# EAGLE design Faudraj (EAGLE 7.6.0)
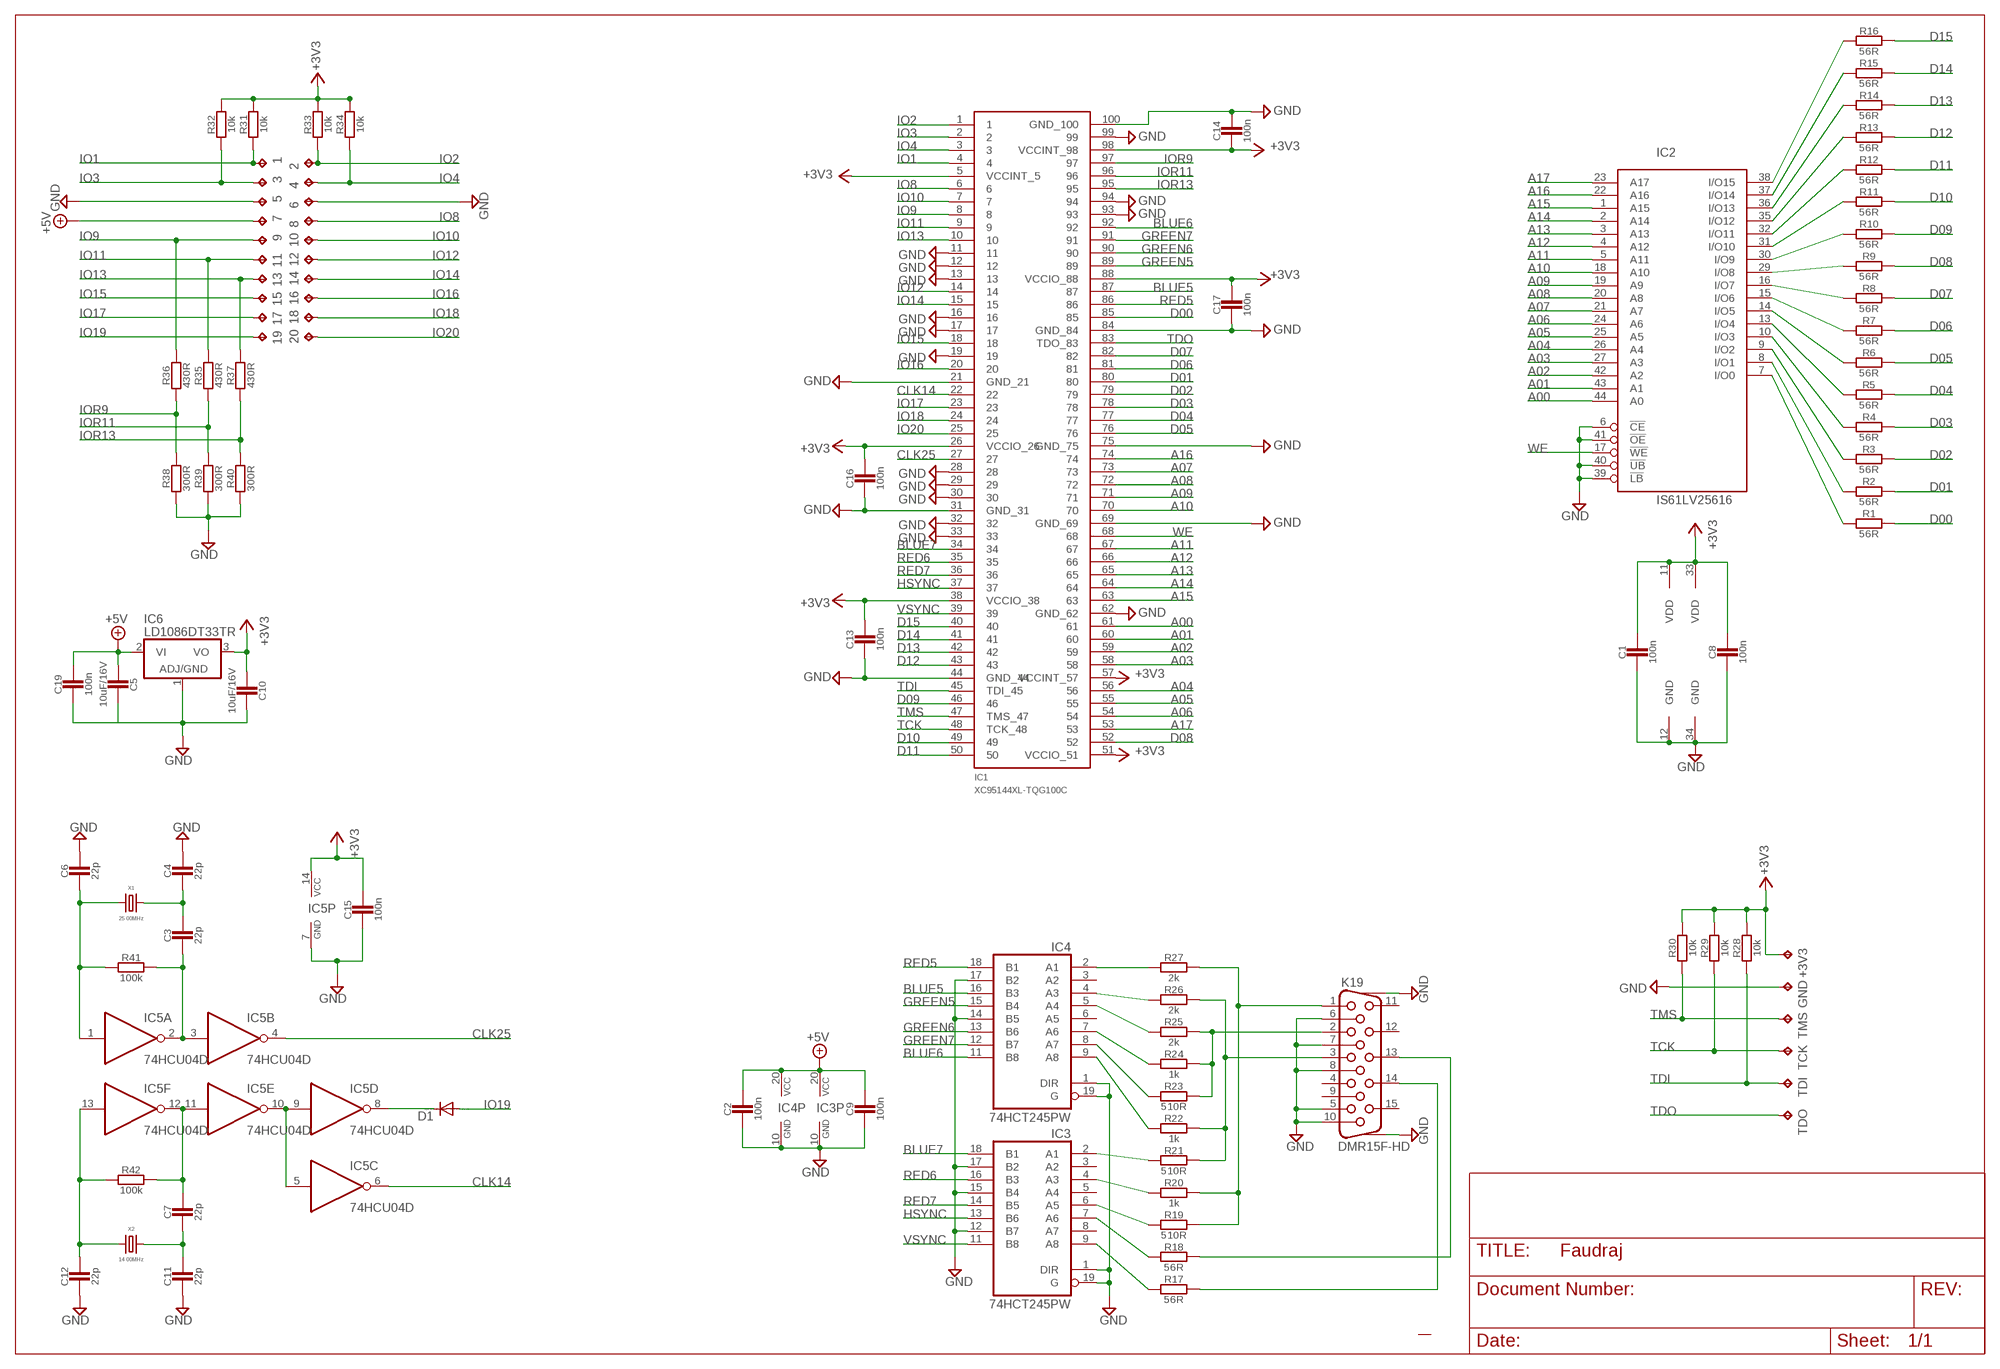
[diagram p0: schematic, sheet 1]

## Parts
1  nic  TPTP20R  [TP20R]
2  nic  TPTP20R  [TP20R]
3  nic  TPTP20R  [TP20R]
4  nic  TPTP20R  [TP20R]
5  nic  TPTP20R  [TP20R]
6  nic  TPTP20R  [TP20R]
7  nic  TPTP20R  [TP20R]
8  nic  TPTP20R  [TP20R]
9  nic  TPTP20R  [TP20R]
10  nic  TPTP20R  [TP20R]
11  nic  TPTP20R  [TP20R]
12  nic  TPTP20R  [TP20R]
13  nic  TPTP20R  [TP20R]
14  nic  TPTP20R  [TP20R]
15  nic  TPTP20R  [TP20R]
16  nic  TPTP20R  [TP20R]
17  nic  TPTP20R  [TP20R]
18  nic  TPTP20R  [TP20R]
19  nic  TPTP20R  [TP20R]
20  nic  TPTP20R  [TP20R]
+3V3  nic  TPTP20R  [TP20R]
C1  100n  CSMD0603  [SMD0603]
C2  100n  CSMD0603  [SMD0603]
C3  22p  CSMD0603  [SMD0603]
C4  22p  CSMD0603  [SMD0603]
C5  10uF/16V  CSMD1206  [SMD1206]
C6  22p  CSMD0603  [SMD0603]
C7  22p  CSMD0603  [SMD0603]
C8  100n  CSMD0603  [SMD0603]
C9  100n  CSMD0603  [SMD0603]
C10  10uF/16V  CSMD1206  [SMD1206]
C11  22p  CSMD0603  [SMD0603]
C12  22p  CSMD0603  [SMD0603]
C13  100n  CSMD0603  [SMD0603]
C14  100n  CSMD0603  [SMD0603]
C15  100n  CSMD0603  [SMD0603]
C16  100n  CSMD0603  [SMD0603]
C17  100n  CSMD0603  [SMD0603]
C19  100n  CSMD0603  [SMD0603]
D1  DIODE-MINIMELF  [MINIMELF]
GND  nic  TPTP20R  [TP20R]
IC1  XC95144XL-TQG100C  XC95144XL100  [TQFP100]
IC2  IS61LV25616  IS61C25616AL-10T  [TSOP-II-44]
IC3  74HCT245PW  74245PW  [TSSOP20]
IC4  74HCT245PW  74245PW  [TSSOP20]
IC5  74HCU04D  74HCT04D  [SO14]
IC6  LD1086DT33TR  LM1117DT  [TO252]
K19  DMR15F-HD  HF15G  [HF15G]
R1  56R  RSMD0603  [SMD0603]
R2  56R  RSMD0603  [SMD0603]
R3  56R  RSMD0603  [SMD0603]
R4  56R  RSMD0603  [SMD0603]
R5  56R  RSMD0603  [SMD0603]
R6  56R  RSMD0603  [SMD0603]
R7  56R  RSMD0603  [SMD0603]
R8  56R  RSMD0603  [SMD0603]
R9  56R  RSMD0603  [SMD0603]
R10  56R  RSMD0603  [SMD0603]
R11  56R  RSMD0603  [SMD0603]
R12  56R  RSMD0603  [SMD0603]
R13  56R  RSMD0603  [SMD0603]
R14  56R  RSMD0603  [SMD0603]
R15  56R  RSMD0603  [SMD0603]
R16  56R  RSMD0603  [SMD0603]
R17  56R  RSMD0603  [SMD0603]
R18  56R  RSMD0603  [SMD0603]
R19  510R  RSMD0603  [SMD0603]
R20  1k  RSMD0603  [SMD0603]
R21  510R  RSMD0603  [SMD0603]
R22  1k  RSMD0603  [SMD0603]
R23  510R  RSMD0603  [SMD0603]
R24  1k  RSMD0603  [SMD0603]
R25  2k  RSMD0603  [SMD0603]
R26  2k  RSMD0603  [SMD0603]
R27  2k  RSMD0603  [SMD0603]
R28  10k  RSMD0603  [SMD0603]
R29  10k  RSMD0603  [SMD0603]
R30  10k  RSMD0603  [SMD0603]
R31  10k  RSMD0603  [SMD0603]
R32  10k  RSMD0603  [SMD0603]
R33  10k  RSMD0603  [SMD0603]
R34  10k  RSMD0603  [SMD0603]
R35  430R  RSMD0603  [SMD0603]
R36  430R  RSMD0603  [SMD0603]
R37  430R  RSMD0603  [SMD0603]
R38  300R  RSMD0603  [SMD0603]
R39  300R  RSMD0603  [SMD0603]
R40  300R  RSMD0603  [SMD0603]
R41  100k  RSMD0603  [SMD0603]
R42  100k  RSMD0603  [SMD0603]
SJ1  nic  OTVOR3.2  [OTVOR3.2]
TCK  nic  TPTP20R  [TP20R]
TDI  nic  TPTP20R  [TP20R]
TDO  nic  TPTP20R  [TP20R]
TMS  nic  TPTP20R  [TP20R]
X1  25.00MHz  CRYSTALHC49U-V  [HC49U-V]
X2  14.00MHz  CRYSTALHC49U-V  [HC49U-V]

## Nets
+3V3: +3V3.TP C1.1 C8.1 C10.2 C13.1 C14.2 C15.1 C16.1 C17.1 IC1.5(VCCINT_5) IC1.26(VCCIO_26) IC1.38(VCCIO_38) IC1.51(VCCIO_51) IC1.57(VCCINT_57) IC1.88(VCCIO_88) IC1.98(VCCINT_98) IC2.11(VDD) IC2.33(VDD) IC5.14(P:VCC) IC6.3(VO) R28.2 R29.2 R30.2 R31.2 R32.2 R33.2 R34.2
+5V: 7.TP C2.1 C5.2 C9.1 C19.1 IC3.20(VCC) IC4.20(VCC) IC6.2(VI)
A00: IC1.61 IC2.44(A0)
A01: IC1.60 IC2.43(A1)
A02: IC1.59 IC2.42(A2)
A03: IC1.58 IC2.27(A3)
A04: IC1.56 IC2.26(A4)
A05: IC1.55 IC2.25(A5)
A06: IC1.54 IC2.24(A6)
A07: IC1.73 IC2.21(A7)
A08: IC1.72 IC2.20(A8)
A09: IC1.71 IC2.19(A9)
A10: IC1.70 IC2.18(A10)
A11: IC1.67 IC2.5(A11)
A12: IC1.66 IC2.4(A12)
A13: IC1.65 IC2.3(A13)
A14: IC1.64 IC2.2(A14)
A15: IC1.63 IC2.1(A15)
A16: IC1.74 IC2.22(A16)
A17: IC1.53 IC2.23(A17)
B5: IC4.4(A3) R26.1
B6: IC4.9(A8) R22.1
B7: IC3.2(A1) R21.1
BLUE5: IC1.87 IC4.16(B3)
BLUE6: IC1.92 IC4.11(B8)
BLUE7: IC1.34 IC3.18(B1)
CLK14: IC1.22 IC5.6(C:O)
CLK25: IC1.27 IC5.4(B:O)
D00: IC1.85 R1.2
D01: IC1.80 R2.2
D02: IC1.79 R3.2
D03: IC1.78 R4.2
D04: IC1.77 R5.2
D05: IC1.76 R6.2
D06: IC1.81 R7.2
D07: IC1.82 R8.2
D08: IC1.52 R9.2
D09: IC1.46 R10.2
D10: IC1.49 R11.2
D11: IC1.50 R12.2
D12: IC1.43 R13.2
D13: IC1.42 R14.2
D14: IC1.41 R15.2
D15: IC1.40 R16.2
G5: IC4.5(A4) R25.1
G6: IC4.7(A6) R24.1
G7: IC4.8(A7) R23.1
GND: 5.TP 6.TP C1.2 C2.2 C4.1 C5.1 C6.1 C8.2 C9.2 C10.1 C11.2 C12.2 C13.2 C14.1 C15.2 C16.2 C17.2 C19.2 GND.TP IC1.11 IC1.12 IC1.13 IC1.16 IC1.17 IC1.19 IC1.21(GND_21) IC1.28 IC1.29 IC1.30 IC1.31(GND_31) IC1.32 IC1.33 IC1.44(GND_44) IC1.62(GND_62) IC1.69(GND_69) IC1.75(GND_75) IC1.84(GND_84) IC1.93 IC1.94 IC1.99 IC1.100(GND_100) IC2.6(!CE) IC2.12(GND) IC2.34(GND) IC2.39(!LB) IC2.40(!UB) IC2.41(!OE) IC3.1(DIR) IC3.10(GND) IC3.12(B7) IC3.15(B4) IC3.17(B2) IC3.19(G) IC4.1(DIR) IC4.10(GND) IC4.14(B5) IC4.17(B2) IC4.19(G) IC5.7(P:GND) IC6.1(ADJ_GND) K19.5 K19.6 K19.7 K19.8 K19.10 K19.G1 K19.G2 R38.1 R39.1 R40.1
GREEN5: IC1.89 IC4.15(B4)
GREEN6: IC1.90 IC4.13(B6)
GREEN7: IC1.91 IC4.12(B7)
HS: IC3.7(A6) R18.1
HSYNC: IC1.37 IC3.13(B6)
IO1: 1.TP IC1.4 R31.1
IO2: 2.TP IC1.1 R33.1
IO3: 3.TP IC1.2 R32.1
IO4: 4.TP IC1.3 R34.1
IO8: 8.TP IC1.6
IO9: 9.TP IC1.8 R36.2
IO10: 10.TP IC1.7
IO11: 11.TP IC1.9 R35.2
IO12: 12.TP IC1.14
IO13: 13.TP IC1.10 R37.2
IO14: 14.TP IC1.15
IO15: 15.TP IC1.18
IO16: 16.TP IC1.20
IO17: 17.TP IC1.23
IO18: 18.TP IC1.24
IO19: 19.TP D1.A
IO20: 20.TP IC1.25
IOR9: IC1.97 R36.1 R38.2
IOR11: IC1.96 R35.1 R39.2
IOR13: IC1.95 R37.1 R40.2
N$1: IC2.7(I/O0) R1.1
N$2: IC2.16(I/O7) R8.1
N$3: IC2.29(I/O8) R9.1
N$4: C6.2 IC5.1(A:I) R41.1 X1.2
N$5: C3.2 IC5.2(A:O) IC5.3(B:I) R41.2
N$6: IC2.15(I/O6) R7.1
N$7: IC2.14(I/O5) R6.1
N$8: IC2.13(I/O4) R5.1
N$9: IC2.10(I/O3) R4.1
N$10: IC2.9(I/O2) R3.1
N$11: IC2.8(I/O1) R2.1
N$12: IC2.30(I/O9) R10.1
N$13: IC2.31(I/O10) R11.1
N$14: IC2.32(I/O11) R12.1
N$15: IC2.35(I/O12) R13.1
N$16: IC2.36(I/O13) R14.1
N$17: IC2.37(I/O14) R15.1
N$18: IC2.38(I/O15) R16.1
N$19: C3.1 C4.2 X1.1
N$20: C7.1 IC5.11(E:I) IC5.12(F:O) R42.2
N$21: IC5.5(C:I) IC5.9(D:I) IC5.10(E:O)
N$22: D1.C IC5.8(D:O)
N$23: C12.1 IC5.13(F:I) R42.1 X2.2
N$25: C7.2 C11.1 X2.1
R5: IC4.2(A1) R27.1
R6: IC3.4(A3) R20.1
R7: IC3.6(A5) R19.1
RED5: IC1.86 IC4.18(B1)
RED6: IC1.35 IC3.16(B3)
RED7: IC1.36 IC3.14(B5)
TCK: IC1.48(TCK_48) R29.1 TCK.TP
TDI: IC1.45(TDI_45) R28.1 TDI.TP
TDO: IC1.83(TDO_83) TDO.TP
TMS: IC1.47(TMS_47) R30.1 TMS.TP
VGA_BLUE: K19.3 R21.2 R22.2 R26.2
VGA_GREEN: K19.2 R23.2 R24.2 R25.2
VGA_HSYNC: K19.13 R18.2
VGA_RED: K19.1 R19.2 R20.2 R27.2
VGA_VSYNC: K19.14 R17.2
VS: IC3.9(A8) R17.1
VSYNC: IC1.39 IC3.11(B8)
WE: IC1.68 IC2.17(!WE)
Unconnected: IC3.3(A2) IC3.5(A4) IC3.8(A7) IC4.3(A2) IC4.6(A5) K19.4 K19.9 K19.11 K19.12 K19.15 SJ1.OTVOR@1 SJ1.OTVOR@2 SJ1.OTVOR@3 SJ1.OTVOR@4 SJ1.OTVOR@5 SJ1.OTVOR@6 SJ1.OTVOR@7 SJ1.OTVOR@8 SJ1.OTVOR@9

## Library data of the parts
1-20 +3V3 GND TCK TDI TDO TMS = testpad:TP: Test pad
C1-C17 C19 = RCL:C: CAPACITOR, European symbol
D1 = diode:DIODE-: DIODE
IC1 = roman:XC95144XL100
IC2 = memory-issi-asynsram:IS61C25616AL-*: 256k x 16 high- speed CMOS static RAM 10ns access time 5V power supply
IC3 IC4 = 74xx-eu:74*245: Octal BUS TRANSCEIVER, 3-state
IC5 = 74xx-eu:74*04: Hex INVERTER
IC6 = roman:LM1117*
K19 = roman:HF15G
R1-R42 = RCL:R: RESISTOR, European symbol
SJ1 = SroubOtvor:OTVOR
X1 X2 = crystal:CRYSTAL: CRYSTAL; OC_FARNELL: 1666969; OC_NEWARK: unknown

## Net classes
0 default: width 0.2 mm, drill 0.2 mm, clearance 0.15 mm
1 diff_buss: width 0.16 mm, drill 0.2 mm, clearance 0.2 mm

## Board
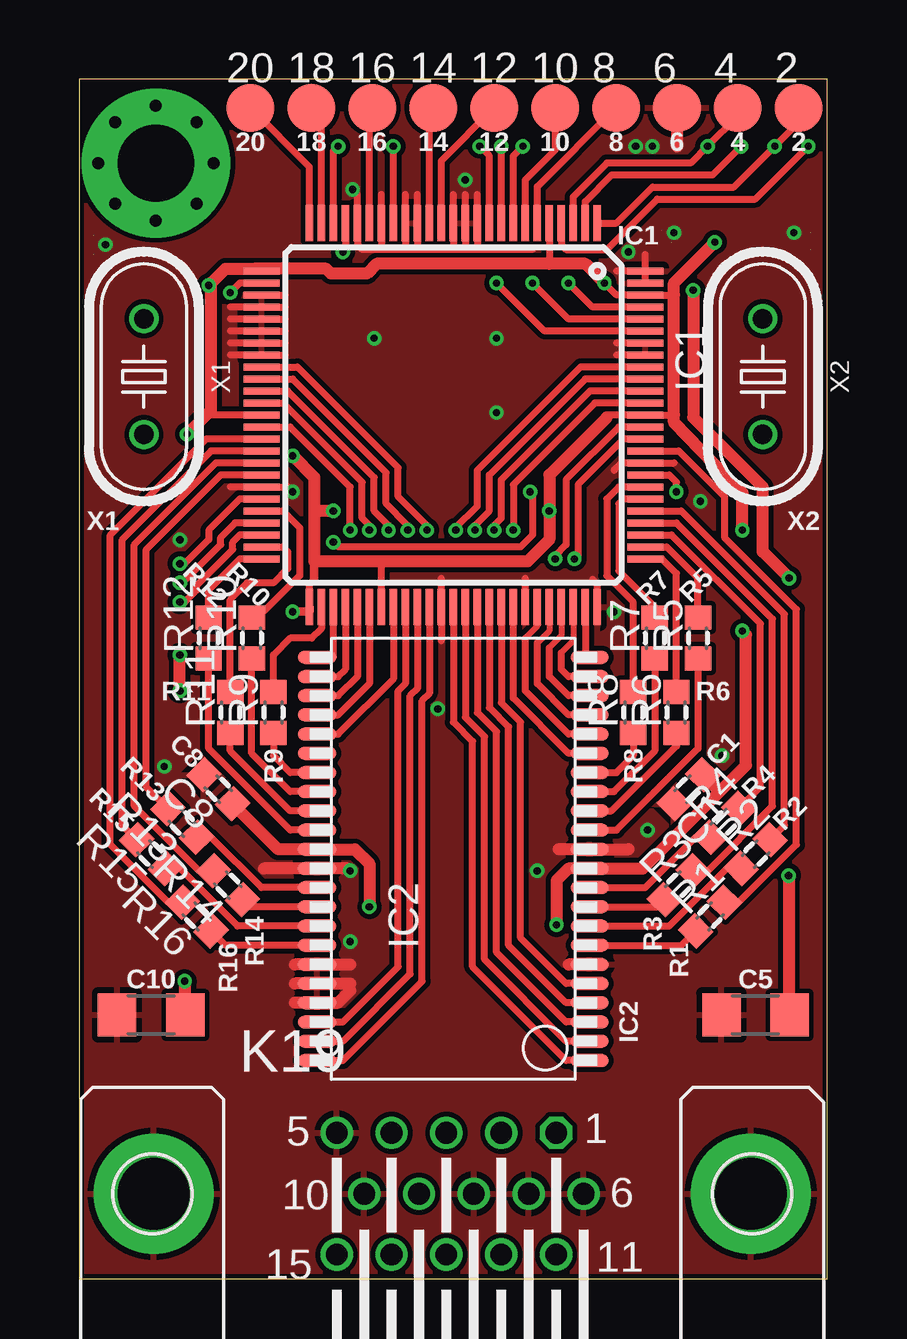
[diagram p1: board, top side]
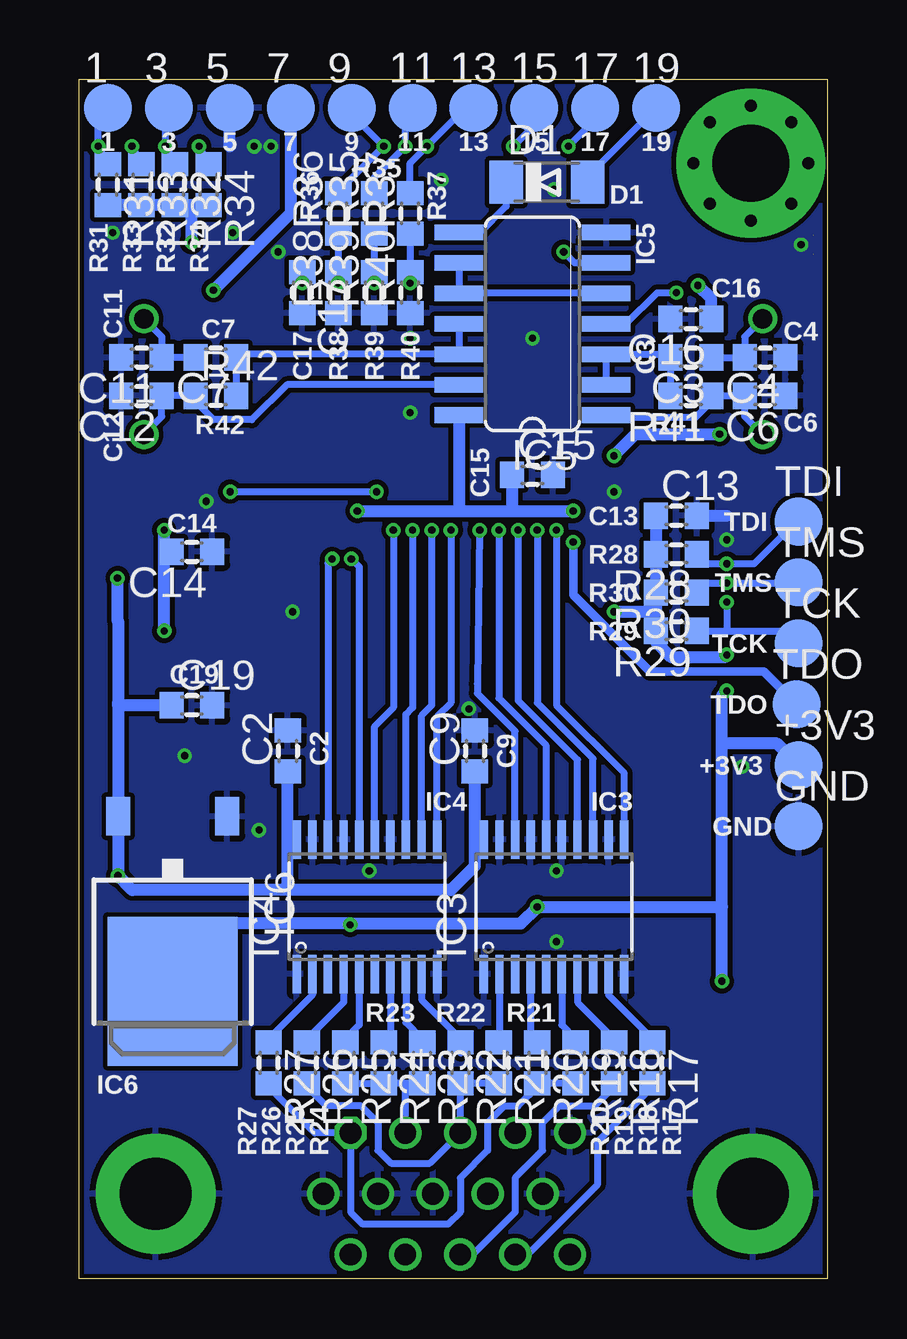
[diagram p2: board, bottom side, seen from below]

Size 31.2 x 50 mm. Coordinates in mm from the lower left corner, seen from the top.
Outline: 0,0 31.2,0 31.2,50 0,50 0,0
Copper layers (1*16): Top 0.035mm / dielectric 1.5mm / Bottom 0.035mm
Design rules "default *": minimum track width 0.2mm, minimum drill 0.3mm, track to track 0.2mm, track to pad 0.2mm, pad to pad 0.2mm, via to via 0.2mm, smd to smd 0.2mm, copper to edge 0.2mm, drill to drill 0.2mm, minimum pad ring 0.15mm, minimum via ring 0.15mm, stop-mask expansion 4mil, vias tented up to drill 1mm, thermal gap 10mil

### Footprints (pad centres in the part's own frame; a part is rotated, then mirrored left to right if it is on the bottom)
TP20R = smd 2 x 2: TP 0,0
SMD0603 = smd 1 x 1.1: 1 -0.85,0; 2 0.85,0
SMD1206 = smd 1.6 x 1.8: 1 -1.422,0; 2 1.422,0
MINIMELF = smd 1.4 x 1.8: A 1.7,0; C -1.7,0
TQFP100 = smd 1.5 x 0.3: 1 -8,6; 2 -8,5.5; 3 -8,5; 4 -8,4.5; 5 -8,4; 6 -8,3.5; 7 -8,3; 8 -8,2.5; 9 -8,2; 10 -8,1.5; 11 -8,1; 12 -8,0.5; 13 -8,0; 14 -8,-0.5; 15 -8,-1; 16 -8,-1.5; 17 -8,-2; 18 -8,-2.5; 19 -8,-3; 20 -8,-3.5; 21 -8,-4; 22 -8,-4.5; 23 -8,-5; 24 -8,-5.5; 25 -8,-6; 51 8,-6; 52 8,-5.5; 53 8,-5; 54 8,-4.5; 55 8,-4; 56 8,-3.5; 57 8,-3; 58 8,-2.5; 59 8,-2; 60 8,-1.5; 61 8,-1; 62 8,-0.5; 63 8,0; 64 8,0.5; 65 8,1; 66 8,1.5; 67 8,2; 68 8,2.5; 69 8,3; 70 8,3.5; 71 8,4; 72 8,4.5; 73 8,5; 74 8,5.5; 75 8,6 | smd 0.3 x 1.5: 26 -6,-8; 27 -5.5,-8; 28 -5,-8; 29 -4.5,-8; 30 -4,-8; 31 -3.5,-8; 32 -3,-8; 33 -2.5,-8; 34 -2,-8; 35 -1.5,-8; 36 -1,-8; 37 -0.5,-8; 38 0,-8; 39 0.5,-8; 40 1,-8; 41 1.5,-8; 42 2,-8; 43 2.5,-8; 44 3,-8; 45 3.5,-8; 46 4,-8; 47 4.5,-8; 48 5,-8; 49 5.5,-8; 50 6,-8; 76 6,8; 77 5.5,8; 78 5,8; 79 4.5,8; 80 4,8; 81 3.5,8; 82 3,8; 83 2.5,8; 84 2,8; 85 1.5,8; 86 1,8; 87 0.5,8; 88 0,8; 89 -0.5,8; 90 -1,8; 91 -1.5,8; 92 -2,8; 93 -2.5,8; 94 -3,8; 95 -3.5,8; 96 -4,8; 97 -4.5,8; 98 -5,8; 99 -5.5,8; 100 -6,8
TSOP-II-44 = smd 0.55 x 1.6: 1 -8.4,-5.68; 2 -7.6,-5.68; 3 -6.8,-5.68; 4 -6,-5.68; 5 -5.2,-5.68; 6 -4.4,-5.68; 7 -3.6,-5.68; 8 -2.8,-5.68; 9 -2,-5.68; 10 -1.2,-5.68; 11 -0.4,-5.68; 12 0.4,-5.68; 13 1.2,-5.68; 14 2,-5.68; 15 2.8,-5.68; 16 3.6,-5.68; 17 4.4,-5.68; 18 5.2,-5.68; 19 6,-5.68; 20 6.8,-5.68; 21 7.6,-5.68; 22 8.4,-5.68; 23 8.4,5.68; 24 7.6,5.68; 25 6.8,5.68; 26 6,5.68; 27 5.2,5.68; 28 4.4,5.68; 29 3.6,5.68; 30 2.8,5.68; 31 2,5.68; 32 1.2,5.68; 33 0.4,5.68; 34 -0.4,5.68; 35 -1.2,5.68; 36 -2,5.68; 37 -2.8,5.68; 38 -3.6,5.68; 39 -4.4,5.68; 40 -5.2,5.68; 41 -6,5.68; 42 -6.8,5.68; 43 -7.6,5.68; 44 -8.4,5.68
TSSOP20 = smd 0.35 x 1.6: 1 -2.925,-2.8; 2 -2.275,-2.8; 3 -1.625,-2.8; 4 -0.975,-2.8; 5 -0.325,-2.8; 6 0.325,-2.8; 7 0.975,-2.8; 8 1.625,-2.8; 9 2.275,-2.8; 10 2.925,-2.8; 11 2.925,2.8; 12 2.275,2.8; 13 1.625,2.8; 14 0.975,2.8; 15 0.325,2.8; 16 -0.325,2.8; 17 -0.975,2.8; 18 -1.625,2.8; 19 -2.275,2.8; 20 -2.925,2.8
SO14 = smd 0.66 x 2.032: 1 -3.81,-3.073; 2 -2.54,-3.073; 3 -1.27,-3.073; 4 0,-3.073; 5 1.27,-3.073; 6 2.54,-3.073; 7 3.81,-3.073; 8 3.81,3.073; 9 2.54,3.073; 10 1.27,3.073; 11 0,3.073; 12 -1.27,3.073; 13 -2.54,3.073; 14 -3.81,3.073
TO252 = smd 1 x 1.6: 1 -2.28,-6.07; 2 2.28,-6.07 | smd 5.4 x 6.2: 3 0,1.23
HF15G = drill 0.9 octagon: 1 4.583,5.08 | drill 0.9: 2 2.297,5.08; 3 0.011,5.08; 4 -2.275,5.08; 5 -4.561,5.08; 6 5.726,2.54; 7 3.44,2.54; 8 1.154,2.54; 9 -1.132,2.54; 10 -3.418,2.54; 11 4.583,0; 12 2.297,0; 13 0.011,0; 14 -2.275,0; 15 -4.561,0 | drill 3 pad 5: G1 -12.192,2.54; G2 12.7,2.54
OTVOR3.2 = drill 3.2 pad 6.2: OTVOR@1 0,0 | drill 0.5: OTVOR@2 0,2.4; OTVOR@3 1.7,1.7; OTVOR@4 2.4,0; OTVOR@5 1.7,-1.7; OTVOR@6 0,-2.4; OTVOR@7 -1.7,-1.7; OTVOR@8 -2.4,0; OTVOR@9 -1.7,1.7
HC49U-V = drill 0.813: 1 -2.413,0; 2 2.413,0

### Placement (x,y rotation side)
1  30,48.8 0 bottom
2  30,48.8 0 top
3  27.46,48.8 0 bottom
4  27.46,48.8 0 top
5  24.92,48.8 0 bottom
6  24.92,48.8 0 top
7  22.38,48.8 0 bottom
8  22.38,48.8 0 top
9  19.84,48.8 0 bottom
10  19.84,48.8 0 top
11  17.3,48.8 0 bottom
12  17.3,48.8 0 top
13  14.76,48.8 0 bottom
14  14.76,48.8 0 top
15  12.22,48.8 0 bottom
16  12.22,48.8 0 top
17  9.68,48.8 0 bottom
18  9.68,48.8 0 top
19  7.14,48.8 0 bottom
20  7.14,48.8 0 top
+3V3  1.2,21.4 0 bottom
C1  25.4,20.4 225 top
C2  22.5,22 90 bottom
C3  5.7,38.4 180 bottom
C4  2.6,38.4 180 bottom
C5  28.2,11 0 top
C6  2.6,36.8 180 bottom
C7  25.5,38.4 180 bottom
C8  5.8,20.4 135 top
C9  14.7,22 90 bottom
C10  3,11 0 top
C11  28.6,38.4 180 bottom
C12  28.6,36.8 180 bottom
C13  6.3,31.8 0 bottom
C14  26.5,30.3 180 bottom
C15  12.3,33.5 0 bottom
C16  5.7,40 180 bottom
C17  21.9,41.1 270 bottom
C19  26.5,23.9 0 bottom
D1  11.7,45.7 0 bottom
GND  1.2,18.86 0 bottom
IC1  15.6,36 270 top
IC2  15.6,17.5 90 top
IC3  11.4,15.5 0 bottom
IC4  19.2,15.5 0 bottom
IC5  12.3,39.8 90 bottom
IC6  27.3,13.2 180 bottom
K19  15.3,1 0 top
R1  26.3,15.1 45 top
R2  28.2,17.7 45 top
R3  25,16.4 45 top
R4  26.9,19 45 top
R5  25.8,26.7 90 top
R6  24.9,23.6 90 top
R7  24,26.7 90 top
R8  23.1,23.6 90 top
R9  8.1,23.6 90 top
R10  7.2,26.7 90 top
R11  6.3,23.6 90 top
R12  5.4,26.7 90 top
R13  4.3,19 135 top
R14  6.2,16.4 135 top
R15  3,17.7 135 top
R16  4.9,15.1 135 top
R17  7.3,9 270 bottom
R18  8.9,9 270 bottom
R19  10.5,9 270 bottom
R20  12.1,9 270 bottom
R21  13.7,9 270 bottom
R22  15.3,9 270 bottom
R23  16.9,9 270 bottom
R24  18.5,9 270 bottom
R25  20.1,9 270 bottom
R26  21.7,9 270 bottom
R27  23.3,9 270 bottom
R28  6.3,30.2 180 bottom
R29  6.3,27 180 bottom
R30  6.3,28.6 180 bottom
R31  30,45.6 270 bottom
R32  27.2,45.6 270 bottom
R33  28.6,45.6 270 bottom
R34  25.8,45.6 270 bottom
R35  18.9,44.4 90 bottom
R36  20.4,44.4 90 bottom
R37  17.4,44.4 90 bottom
R38  20.4,41.1 90 bottom
R39  18.9,41.1 90 bottom
R40  17.4,41.1 90 bottom
R41  5.7,36.8 180 bottom
R42  25.5,36.8 0 bottom
SJ1  3.2,46.5 0 top
TCK  1.2,26.48 0 bottom
TDI  1.2,31.56 0 bottom
TDO  1.3,23.94 0 bottom
TMS  1.2,29.02 0 bottom
X1  2.7,37.6 270 top
X2  28.5,37.6 270 top

### Tracks (layer width: path | path; a pad name or v marks a point on that pad's centre or on a via)
+3V3  (via drill 0.3)
  Top 0.3: IC1.26 7.3,42.1 | IC1.57 12.6,29.9 | IC1.51 9.6,28.95 9.8,29.15 | 24.8,36 IC1.88 22.1,36 22,35.9 | 24.8,41 IC1.98 22.4,41 v21.9,41.5 | IC1.5 19.6,42.3 | IC1.38 5.5,36 5.5,36.2
  Top 0.35: 9.8,29.15 9.8,29.9 | IC1.51 9.6,27.8 v8.9,27.8
  Top 0.5: 22,35.9 19.6,33.5 v19.6,32 19.6,30.8 18.7,29.9 12.6,29.9 9.8,29.9 9.8,32 | 5.5,41.5 6.1,42.1 7.3,42.1 10.3,42.1 10.5,41.9 12,41.9 12.4,42.3 19.6,42.3 21.1,42.3 v21.9,41.5 | C8.1 8.3,17.9 IC2.33 11.5,17.9 12.1,17.3 v12.1,15.5 | 26.65,20.25 23.5,17.1 IC2.11 20.4,17.1 19.9,16.6 v19.9,14.75 | 26.65,20.25 27.8,21.4 27.8,26.85 v27.65,27 | v4.2,24.5 v4.2,26 | v4.4,12.4 4.4,11 C10.2 | C1.1 26.65,20.35 26.65,20.25 | v27.65,31.2 27.65,32.75 24.8,35.7 24.8,36 24.8,41 24.8,41.5 v26.5,43.2 | v8.9,34.3 9.8,33.4 9.8,32 | v10.6,32 9.8,32 | 5.5,41.5 5.5,36.2 v4.5,35.2 | 5.5,41.5 v5.4,41.4
  Bottom 0.5: v19.6,32 15.37,32 | C17.1 v21.9,41.5 | IC5.14 15.37,32 | 19.9,14.8 12.8,14.8 v12.1,15.5 4.4,15.5 | v19.9,14.75 19.9,14.8 | C13.1 R28.2 R30.2 7.15,27.8 | 7.15,27.8 R29.2 7.15,26.55 6.5,25.9 4.3,25.9 v4.2,26 | v8.9,27.8 7.15,27.8 | 19.9,14.8 27.3,14.8 IC6.3 | v4.4,12.4 4.4,15.5 | v27.65,27 27.65,30.3 | 27.65,30.3 v27.65,31.2 | R34.2 26.5,44.75 | 26.5,44.75 R32.2 R33.2 R31.2 | 15.37,32 13.15,32 | 13.15,32 v10.6,32 | v8.9,34.3 8,35.2 v4.5,35.2 | C14.2 27.65,30.3 | v26.5,43.2 26.5,44.75 | C16.1 4.85,40.85 v5.4,41.4 | 4.4,15.5 4.4,22.3 | 4.4,22.3 4.4,24.3 v4.2,24.5 | +3V3.TP 2.1,22.3 4.4,22.3 | C15.1 13.15,32
+5V  (via drill 0.3)
  Top 0.5: v29.58,16.8 29.58,10.8 C5.2 | v29.6,29.2 28.5,30.3 28.5,33 25.6,35.9 v25.6,41.2
  Bottom 0.3: IC3.20 14.7,18.3 | IC4.20 22.5,18.3
  Bottom 0.5: 29.58,23.9 IC6.2 v29.58,16.8 28.98,16.2 22.5,16.2 | C9.1 14.7,18.3 14.7,17.2 15.7,16.2 22.5,16.2 | 22.5,16.2 22.5,18.3 C2.1 | 7.TP 22.38,44.42 v25.6,41.2 | v29.6,29.2 29.6,27.44 29.58,27.42 29.58,24 29.58,23.9 | C19.1 29.58,23.9
A00
  Top 0.3: IC2.44 11,9.1 14.3,12.4 14.3,24.1 14.6,24.4 IC1.61
A01
  Top 0.3: IC2.43 11,9.9 13.8,12.7 13.8,24.3 14.1,24.6 IC1.60
A02
  Top 0.3: IC2.42 11,10.7 13.3,13 13.3,24.5 13.6,24.8 IC1.59
A03
  Top 0.3: IC2.27 10.8,22.7 13.1,25 IC1.58
A04
  Top 0.3: IC2.26 10.8,23.5 12.1,24.8 IC1.56
A05
  Top 0.3: IC2.25 10.8,24.3 11.6,25.1 IC1.55
A06
  Top 0.3: IC2.24 10.8,25.1 11.1,25.4 IC1.54
A07
  Top 0.25: IC1.73 20.6,26.6 20.1,26.1
  Top 0.3: IC2.21 20.4,25.1 20.1,25.4 20.1,26.1
A08
  Top 0.25: IC1.72 20.1,26.8 19.6,26.3
  Top 0.3: IC2.20 20.4,24.3 19.6,25.1 19.6,26.3
A09
  Top 0.25: IC1.71 19.6,27 19.1,26.5
  Top 0.3: IC2.19 20.4,23.5 19.1,24.8 19.1,26.5
A10
  Top 0.25: IC1.70 19.1,27.2 18.6,26.7
  Top 0.3: IC2.18 20.4,22.7 18.6,24.5 18.6,26.7
A11
  Top 0.3: IC2.5 20.3,12.3 18.4,14.2 18.4,23.2 17.6,24 IC1.67
A12
  Top 0.3: IC2.4 20.3,11.5 17.9,13.9 17.9,23 17.1,23.8 IC1.66
A13
  Top 0.3: IC2.3 20.3,10.7 17.4,13.6 17.4,22.8 16.6,23.6 IC1.65
A14
  Top 0.3: IC2.2 20.3,9.9 16.9,13.3 16.9,22.6 16.1,23.4 IC1.64
A15
  Top 0.3: IC2.1 20.3,9.1 16.4,13 16.4,22.4 15.6,23.2 IC1.63
A16
  Top 0.3: IC1.74 21.1,25.9 IC2.22
A17
  Top 0.3: IC2.23 10.6,25.9 IC1.53
B5
  Bottom 0.3: R26.1 21.7,10 20.18,11.53 IC4.4
B6
  Bottom 0.3: 15.3,9.4 R22.1 15.3,10 16.93,11.62 IC4.9
B7
  Bottom 0.3: IC3.2 13.68,9.88 R21.1
BLUE5  (via drill 0.3)
  Top 0.3: IC1.87 22.5,35.5 20.3,33.3 20.3,30.6 19.85,30.15 v19.85,30
  Bottom 0.3: v19.85,30 19.52,29.68 IC4.16
BLUE6  (via drill 0.3)
  Top 0.3: v15.7,31.2 15.7,31.3 16.6,32.2 16.6,33.7 20.9,38 IC1.92
  Bottom 0.3: v15.7,31.2 15.7,24 16.27,23.43 IC4.11
BLUE7  (via drill 0.3)
  Top 0.3: IC1.34 9.1,38 13.3,33.8 13.3,32.6 14.5,31.4 v14.5,31.2
  Bottom 0.3: v14.5,31.2 14.6,24.8 14.6,24.4 13.03,22.82 IC3.18
CLK14  (via drill 0.3)
  Top 0.3: IC1.22 11.1,42.9 v11,42.8
  Bottom 0.3: IC5.6 10.54,42.34 v11,42.8
CLK25  (via drill 0.3)
  Top 0.3: IC1.27 6.7,41.5 v6.3,41.1
  Bottom 0.3: IC5.4 8.4,39.8 7.1,41.1 v6.3,41.1
D00
  Top 0.3: R1.2 27.5,15.7 29.9,18.1 29.9,27.9 26.9,30.9 26.9,32.6 25,34.5 IC1.85
D01
  Top 0.3: R2.2 29.4,18.9 29.4,27.7 25.1,32 IC1.80
D02
  Top 0.3: R3.2 26.2,17 28.9,19.7 28.9,27.5 24.9,31.5 IC1.79
D03
  Top 0.3: R4.2 28.4,20.5 28.4,27.3 24.7,31 IC1.78
D04
  Top 0.3: IC1.77 24.5,30.5 25.8,29.2 R5.2
D05
  Top 0.3: R6.2 24.9,29.4 24.3,30 IC1.76
D06
  Top 0.3: IC1.81 22.7,32.5 22.5,32.3 22.5,29.5 24,28 R7.2
D07
  Top 0.3: R8.2 23.1,28.2 22,29.3 22,32.5 22.5,33 IC1.82
D08
  Top 0.3: R9.2 8.1,26 8.8,26.7 9.7,26.7 10.1,27.1 IC1.52
D09
  Top 0.3: IC1.46 8.5,32 9.2,31.3 9.2,29.3 7.45,27.55 R10.2
D10
  Top 0.3: IC1.49 8.5,30.5 8.7,30.3 8.7,29.6 8.1,29 7,29 6.3,28.3 R11.2
D11
  Top 0.3: R12.2 5.4,28.7 6.7,30 IC1.50
D12
  Top 0.3: R13.2 2.8,20.5 2.8,30.4 5.9,33.5 IC1.43
D13
  Top 0.3: R14.2 5,17 2.3,19.7 2.3,30.6 5.7,34 IC1.42
D14
  Top 0.3: R15.2 1.8,18.9 1.8,30.8 5.5,34.5 IC1.41
D15
  Top 0.3: R16.2 3.7,15.7 1.3,18.1 1.3,31 5.3,35 IC1.40
G5
  Bottom 0.3: R25.1 20.1,10 19.52,10.57 IC4.5
G6
  Bottom 0.3: IC4.7 18.23,10.12 R24.1
G7
  Bottom 0.3: R23.1 16.9,10 17.57,10.68 IC4.8
GND  (via drill 0.3)  (6 unrouted)
  Top 0.3: 8.6,39.5 IC1.31 6.3,39.5 | 15.1,26.6 IC1.62 15.1,29.2 | IC1.75 21.6,28.95 21.4,29.15 | 22.3,33.7 22.6,34 IC1.84 24.8,34 | IC1.69 18.6,29.2 | 8.7,33 IC1.44 6.3,33 | 11.6,45.2 IC1.21 11.6,43.1 11.8,42.9 12.6,42.9 | IC1.100 23.6,42.7 | IC1.94 22.4,39 | 6.3,40 IC1.30 8.6,40 | 6.3,40.5 IC1.29 8.6,40.5 | 6.3,39 IC1.32 8.6,39 | 6.3,38.5 IC1.33 8.6,38.5 | IC1.28 8.6,41 | IC1.93 22.4,38.5 | IC1.100 22.4,42 | IC1.99 IC1.100 | 18.9,42.9 16.6,42.9 | 16.6,42.9 16.1,42.9 | 16.1,42.9 15.6,42.9 | 15.6,42.9 14.1,42.9 | 14.1,42.9 13.6,42.9 | 13.6,42.9 12.6,42.9 | 12.6,42.9 IC1.19 12.6,45.2 | 13.6,42.9 IC1.17 13.6,45.2 | 14.1,42.9 IC1.16 14.1,45.2 | 15.6,42.9 IC1.13 15.6,45.2 | 16.1,42.9 IC1.12 16.1,45.2 | 16.6,42.9 IC1.11 16.6,45.2
  Top 0.5: IC2.41 10.4,11.5 | 7.7,17.1 IC2.34 11.2,17.1 | 9,13.1 IC2.39 11.3,13.1 | 9,12.3 IC2.40 11.3,12.3 | IC2.41 9,11.5 | 22.9,17.9 IC2.12 20,17.9 | IC2.6 20.4,13.1 | IC2.41 10.8,11.5 11.3,12 | 5.TP 24.92,47.2
  Bottom 0.5: C13.2 4.2,31.8 | 24.92,47.2 5.TP
  other vias: 22.3,27.8 25.9,32.4 19.1,17 11.3,17 4.2,30.8 23.7,18.7 11.4,45.4 8.9,32.8 22.9,42.8 12.3,39.2 17.4,39.2 11.3,14.05 14.95,23.75 3.55,21.35 26.8,21.8 23.2,47.2 24.8,43.6 29.8,43.6 1.1,43.1 16.1,45.8 23.9,47.2 17.4,36.1
  pour Bottom (isolate 0.2, rank 6): 0,0 31.2,0 31.2,50 0,50
  pour Top (isolate 0.2, rank 6): 0,0 31.2,0 31.2,50 0,50
GREEN5  (via drill 0.3)
  Top 0.3: IC1.89 21.5,36.5 18.1,33.1 v18.1,31.2
  Bottom 0.3: v18.1,31.2 18.1,23.8 18.88,23.02 IC4.15
GREEN6  (via drill 0.3)
  Top 0.3: v17.3,31.2 17.3,31.4 17.6,31.7 17.6,33.3 21.3,37 IC1.90
  Bottom 0.3: v17.3,31.2 17.3,23.8 17.57,23.52 IC4.13
GREEN7  (via drill 0.3)
  Top 0.3: v16.5,31.2 16.5,31.4 17.1,32 17.1,33.5 21.1,37.5 IC1.91
  Bottom 0.3: v16.5,31.2 16.5,23.9 16.93,23.48 IC4.12
HS
  Bottom 0.3: R18.1 8.9,10 10.43,11.53 IC3.7
HSYNC  (via drill 0.3)
  Top 0.3: IC1.37 8.5,36.5 11.8,33.2 11.8,31.7 12.1,31.4 v12.1,31.2
  Bottom 0.3: v12.1,31.2 12.1,24 9.78,21.68 IC3.13
IO1  (via drill 0.3)
  Top 0.3: v30.4,47.2 28.2,45 24.1,45 22,42.9 20.3,42.9 20.1,43.1 IC1.4
  Bottom 0.3: 1.TP 30.4,48.4 v30.4,47.2 R31.1
IO2  (via drill 0.3)
  Top 0.3: IC1.1 22.4,44 23.9,45.5 27.3,45.5 v29,47.2 30,48.2 2.TP
  Bottom 0.3: v29,47.2 R33.1
IO3  (via drill 0.3)
  Top 0.3: IC1.2 21.1,44.9 22.2,46 26.4,46 v27.6,47.2
  Bottom 0.3: 3.TP 27.6,48.66 v27.6,47.2 R32.1
IO4  (via drill 0.3)
  Top 0.3: 4.TP 27.46,48.46 v26.2,47.2 25.5,46.5 22,46.5 20.6,45.1 IC1.3
  Bottom 0.3: v26.2,47.2 R34.1
IO8
  Top 0.3: IC1.6 19.1,45.52 8.TP
IO9  (via drill 0.3)
  Top 0.3: IC1.8 18.1,46.8 v18.5,47.2
  Bottom 0.3: 19.84,48.94 9.TP | 19.64,48.74 9.TP | 9.TP 19.84,48.54 v18.5,47.2 20.4,45.3 R36.2
IO10
  Top 0.3: IC1.7 18.6,45.8 19.84,47.04 10.TP
IO11  (via drill 0.3)
  Top 0.3: IC1.9 v17.6,47.2
  Bottom 0.3: 11.TP 17.6,48.5 v17.6,47.2 18.9,45.9 R35.2
IO12
  Top 0.3: IC1.14 15.1,46.6 12.TP
IO13  (via drill 0.3)
  Top 0.3: IC1.10 17.1,46.8 v16.7,47.2
  Bottom 0.3: 14.9,48.8 13.TP 15.1,48.8 v16.7,47.2 17.4,46.5 R37.2
IO14
  Top 0.3: IC1.15 14.6,48.64 14.TP
IO15  (via drill 0.3)
  Top 0.3: IC1.18 v13.1,47.2
  Bottom 0.3: v13.1,47.2 12.22,48.08 15.TP
IO16
  Top 0.3: IC1.20 12.1,48.68 16.TP
IO17  (via drill 0.3)
  Top 0.3: IC1.23 10.6,47 v10.8,47.2
  Bottom 0.3: v10.8,47.2 9.68,48.32 17.TP
IO18
  Top 0.3: IC1.24 10.1,48.38 18.TP
IO19
  Bottom 0.3: 19.TP 10.24,45.7 D1.A
IO20
  Top 0.3: IC1.25 9.6,46.34 20.TP
IOR9  (via drill 0.3)
  Top 0.3: IC1.97 21.4,40.5 v20.4,41.5
  Bottom 0.3: R38.2 v20.4,41.5 R36.1
IOR11  (via drill 0.3)
  Top 0.3: IC1.96 20.4,40 v18.9,41.5
  Bottom 0.3: R39.2 v18.9,41.5 R35.1
IOR13  (via drill 0.3)
  Top 0.3: IC1.95 19.4,39.5 v17.4,41.5
  Bottom 0.3: R37.1 v17.4,41.5 R40.2
N$1
  Top 0.3: IC2.7 25.1,13.9 R1.1
N$2
  Top 0.3: IC2.16 22.4,21.1 23.1,21.8 R8.1
N$3
  Top 0.3: IC2.29 8.8,21.1 8.1,21.8 R9.1
N$4
  Bottom 0.3: 9.16,36 IC5.1 9.14,35.9 5.5,35.9 4.85,36.55 R41.1 C6.2 3.45,35.94 X1.2
N$5
  Bottom 0.3: R41.2 C3.2 6.68,38.53 IC5.3 IC5.2
N$6
  Top 0.3: R7.1 24,22 22.3,20.3 IC2.15
N$7
  Top 0.3: IC2.14 22.2,19.5 24.9,22.2 R6.1
N$8
  Top 0.3: IC2.13 22.4,18.7 25.8,22.1 R5.1
N$9
  Top 0.3: IC2.10 23.6,16.3 25.7,18.4 R4.1
N$10
  Top 0.3: IC2.9 24.1,15.5 R3.1
N$11
  Top 0.3: IC2.8 24.6,14.7 27,17.1 R2.1
N$12
  Top 0.3: IC2.30 8.8,20.3 7.2,21.9 R10.1
N$13
  Top 0.3: IC2.31 8.8,19.5 6.3,22 R11.1
N$14
  Top 0.3: IC2.32 8.8,18.7 5.4,22.1 R12.1
N$15
  Top 0.3: IC2.35 7.6,16.3 5.5,18.4 R13.1
N$16
  Top 0.3: IC2.36 7.1,15.5 R14.1
N$17
  Top 0.3: IC2.37 6.6,14.7 4.2,17.1 R15.1
N$18
  Top 0.3: IC2.38 6.1,13.9 R16.1
N$19
  Bottom 0.3: C3.1 C4.2 3.45,39.26 X1.1
N$20
  Bottom 0.3: R42.2 C7.1 24.52,38.53 IC5.12 IC5.11
N$21
  Bottom 0.3: IC5.9 IC5.10 IC5.5
N$22
  Bottom 0.3: IC5.8 14.49,43.61 13.4,44.7 D1.C
N$23
  Bottom 0.3: IC5.13 22.54,37.26 24,35.8 25.6,35.8 26.35,36.55 R42.1 C12.1 27.75,35.94 X2.2
N$25
  Bottom 0.3: C7.2 C11.1 27.75,39.26 X2.1
R5
  Bottom 0.3: R27.1 23.3,10 21.48,11.82 IC4.2
R6
  Bottom 0.3: IC3.4 12.38,10.12 R20.1
R7
  Bottom 0.3: R19.1 10.5,10 11.07,10.57 IC3.6
RED5  (via drill 0.3)
  Top 0.3: IC1.86 22.7,35 20.8,33.1 20.8,30.15 v20.65,30
  Bottom 0.3: v20.65,30 20.82,29.82 IC4.18
RED6  (via drill 0.3)
  Top 0.3: IC1.35 8.9,37.5 12.8,33.6 12.8,32.3 13.7,31.4 v13.7,31.2
  Bottom 0.3: v13.7,31.2 13.7,24.2 11.72,22.23 IC3.16
RED7  (via drill 0.3)
  Top 0.3: IC1.36 8.7,37 12.3,33.4 12.3,32 12.9,31.4 v12.9,31.2
  Bottom 0.3: v12.9,31.2 12.9,24.1 10.43,21.62 IC3.14
TCK  (via drill 0.3)
  Top 0.3: IC1.48 6.7,31 6.4,30.7 6.4,30.4 4.9,28.9 4.9,28.7 4.4,28.2 v4.2,28.2
  Bottom 0.3: R29.1 4.2,27 | 4.2,27 1.72,27 TCK.TP | v4.2,28.2 4.2,27
TDI  (via drill 0.3)
  Top 0.3: IC1.45 6.7,32.5 5.4,31.2 5.4,30.8 4.4,29.8 v4.2,29.8
  Bottom 0.3: R28.1 5.45,29.8 v4.2,29.8 3.06,29.8 1.3,31.56 TDI.TP
TDO  (via drill 0.3)
  Top 0.3: v10.6,30.7 10.8,30.5 18.4,30.5 18.9,31 18.9,32.7 v18.8,32.8 | IC1.83 24.6,33.5 24.9,33.2 v24.9,32.8
  Bottom 0.3: v24.9,32.8 v18.8,32.8
  Bottom 0.35: v10.6,30.7 10.6,28.5 7.4,25.3 2.66,25.3 TDO.TP
TMS  (via drill 0.3)
  Top 0.3: IC1.47 6.5,31.5 5.9,30.9 5.9,30.6 4.3,29 v4.2,29
  Bottom 0.3: R30.1 5.45,29 v4.2,29 1.22,29 TMS.TP
VGA_BLUE
  Bottom 0.3: R21.2 R22.2 15.31,7.95 K19.3 16.58,4.81 18.21,4.81 18.74,5.34 18.74,6.5 19.44,7.2 20.9,7.2 21.7,8 R26.2
VGA_GREEN
  Bottom 0.3: R23.2 17.6,8.15 | R25.2 R24.2 17.6,8.15 | K19.2 17.6,8.15
VGA_HSYNC
  Bottom 0.3: K19.13 14.8,1 13.03,2.77 13.03,4.2 11.88,5.34 11.88,6.5 11.18,7.2 9.7,7.2 8.9,8 R18.2
VGA_RED
  Bottom 0.3: R19.2 R20.2 12.1,8 12.9,7.2 13.47,7.2 14.17,6.5 14.17,5.34 15.31,4.2 15.31,2.77 15.82,2.27 19.38,2.27 19.88,2.77 K19.1 21.38,6.08 23.3,8 R27.2
VGA_VSYNC
  Bottom 0.3: K19.14 12.5,1 9.6,3.9 9.6,5.7 7.3,8 R17.2
VS
  Bottom 0.3: R17.1 7.3,10 9.12,11.82 IC3.9
VSYNC  (via drill 0.3)
  Top 0.3: IC1.39 8.8,35.5 11.3,33 v11.3,31.2
  Bottom 0.3: v11.3,31.2 11.3,23.9 8.47,21.07 IC3.11
WE
  Top 0.3: IC2.17 20.4,21.9 18.1,24.2 IC1.68

### Text on the board
tPlace: 20 | 18 | 16 | 14 | 12 | 10 | 8 | 6 | 4 | 2 | IC1 | X1 | X2 | R12 | R10 | R7 | R5 | R11 | R6 | C8 | R9 | R8 | C1 | R13 | R4 | R15 | R2 | R14 | R3 | R16 | R1 | C10 | C5 | IC2
bPlace: 19 | 17 | 15 | 13 | 11 | 9 | 7 | 5 | 3 | 1 | R35 | D1 | IC5 | R37 | R36 | R34 | R32 | R33 | R31 | C16 | C4 | R40 | R39 | R38 | C17 | C7 | C11 | C3 | C6 | R41 | R42 | C12 | C15 | TDI | C13 | C14 | R28 | TMS | R30 | R29 | TCK | C19 | TDO | C9 | C2 | +3V3 | IC3 | IC4 | GND | R21 | R22 | R23 | IC6 | R17 | R18 | R19 | R20 | R24 | R25 | R26 | R27